# EAGLE schematic shiht_register's_board (EAGLE 8.3.2)
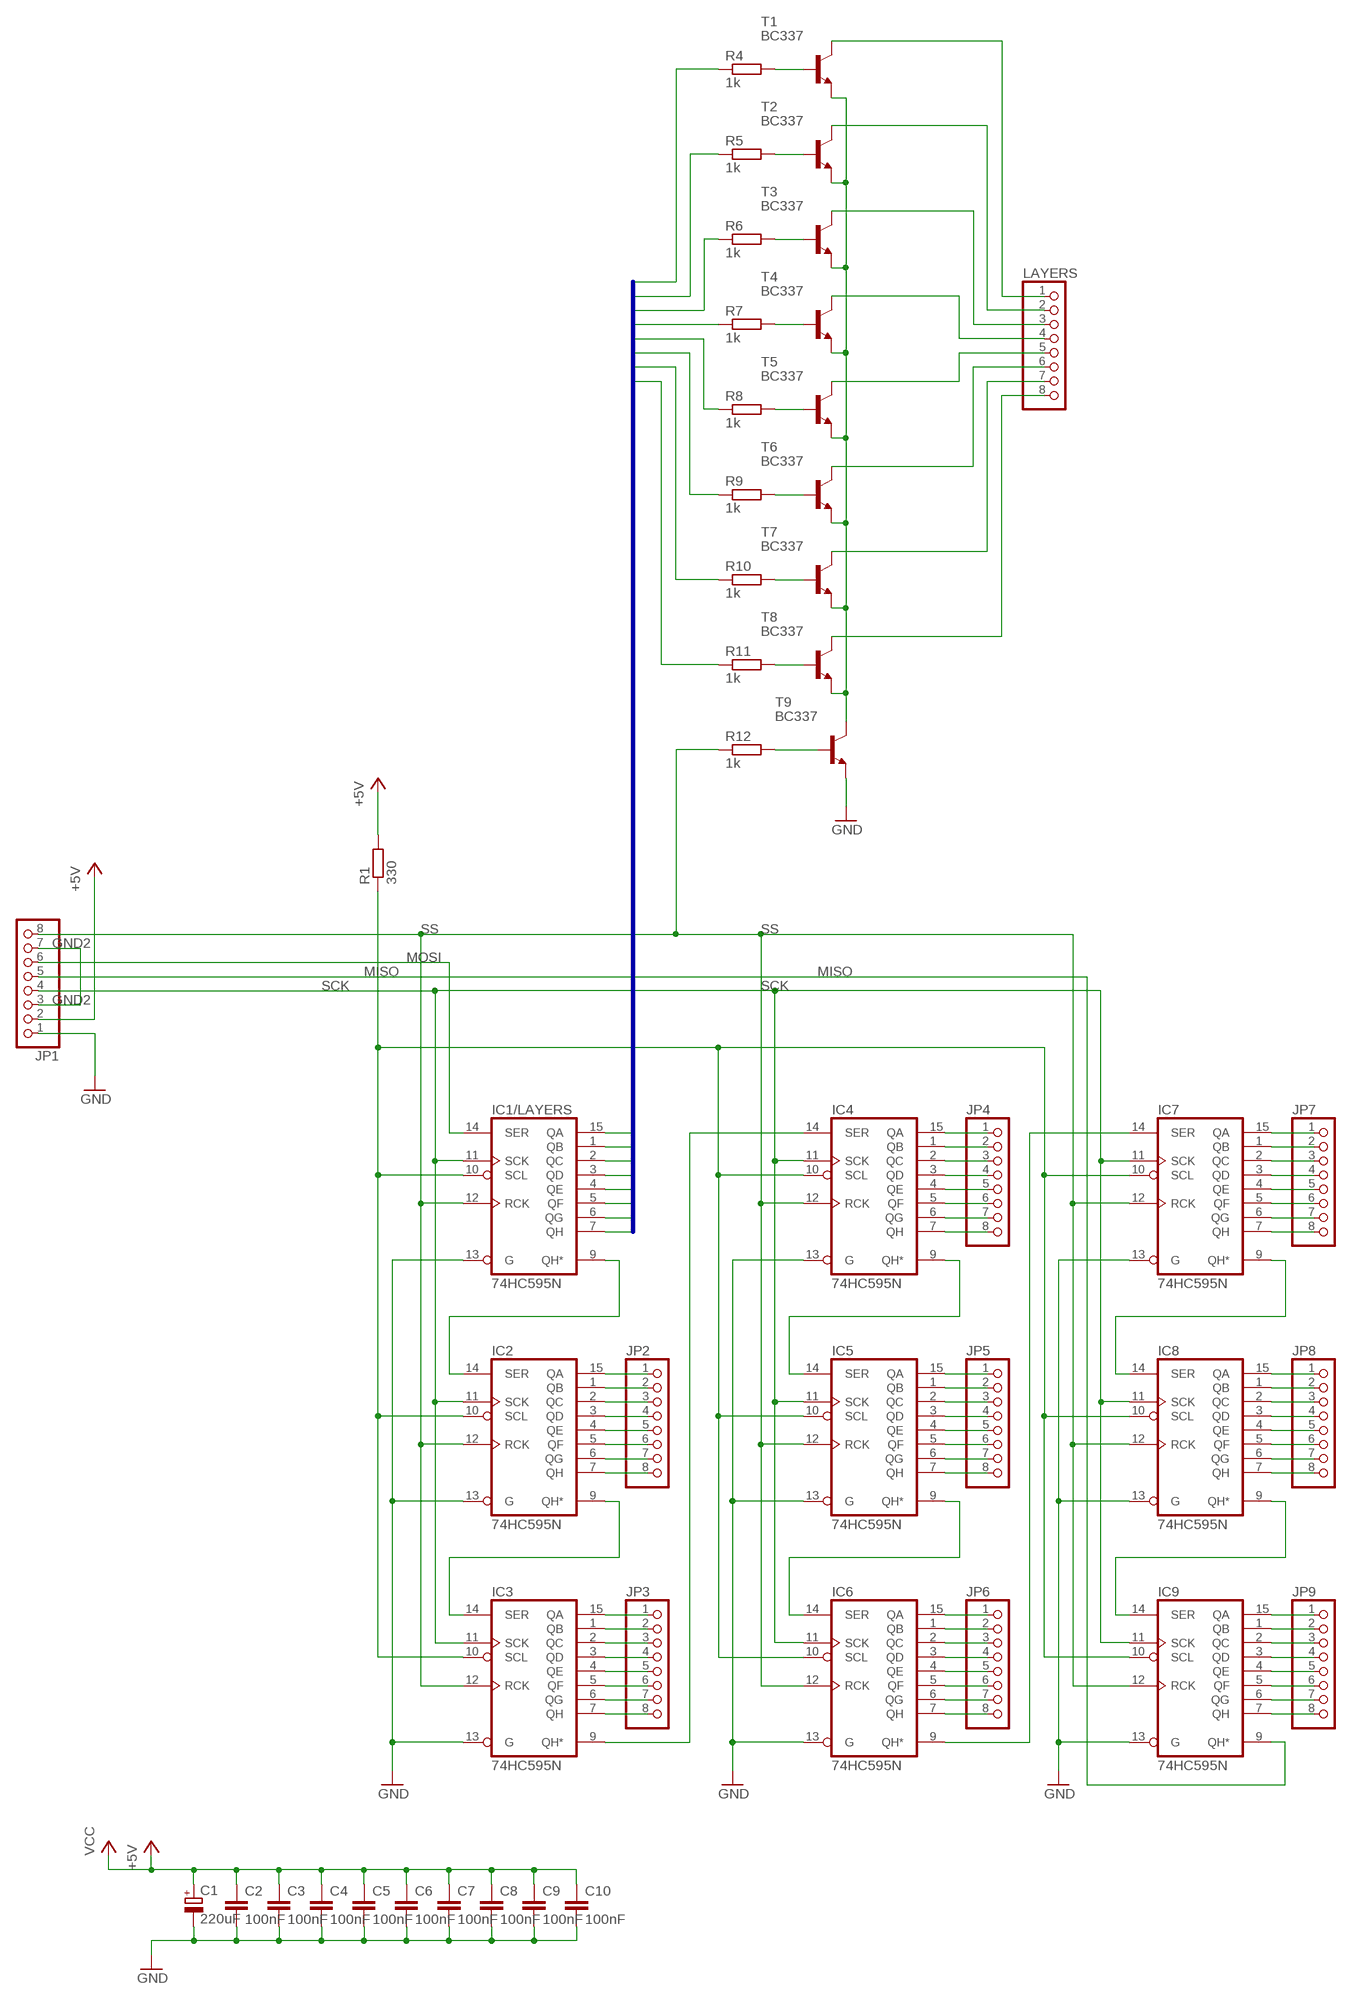
[diagram p0: schematic, sheet 1]

## Parts
C1  220uF  CPOL-EUE3.5-8  [E3,5-8]
C2  100nF  C-EU025-025X050  [C025-025X050]
C3  100nF  C-EU025-025X050  [C025-025X050]
C4  100nF  C-EU025-025X050  [C025-025X050]
C5  100nF  C-EU025-025X050  [C025-025X050]
C6  100nF  C-EU025-025X050  [C025-025X050]
C7  100nF  C-EU025-025X050  [C025-025X050]
C8  100nF  C-EU025-025X050  [C025-025X050]
C9  100nF  C-EU025-025X050  [C025-025X050]
C10  100nF  C-EU025-025X050  [C025-025X050]
IC1/LAYERS  74HC595N  [DIL16]
IC2  74HC595N  [DIL16]
IC3  74HC595N  [DIL16]
IC4  74HC595N  [DIL16]
IC5  74HC595N  [DIL16]
IC6  74HC595N  [DIL16]
IC7  74HC595N  [DIL16]
IC8  74HC595N  [DIL16]
IC9  74HC595N  [DIL16]
JP1  PINHD-1X8  [1X08]
JP2  PINHD-1X8  [1X08]
JP3  PINHD-1X8  [1X08]
JP4  PINHD-1X8  [1X08]
JP5  PINHD-1X8  [1X08]
JP6  PINHD-1X8  [1X08]
JP7  PINHD-1X8  [1X08]
JP8  PINHD-1X8  [1X08]
JP9  PINHD-1X8  [1X08]
LAYERS  PINHD-1X8  [1X08]
R1  330  R-EU_0207/2V  [0207/2V]
R4  1k  R-EU_0207/2V  [0207/2V]
R5  1k  R-EU_0207/2V  [0207/2V]
R6  1k  R-EU_0207/2V  [0207/2V]
R7  1k  R-EU_0207/2V  [0207/2V]
R8  1k  R-EU_0207/2V  [0207/2V]
R9  1k  R-EU_0207/2V  [0207/2V]
R10  1k  R-EU_0207/2V  [0207/2V]
R11  1k  R-EU_0207/2V  [0207/2V]
R12  1k  R-EU_0207/2V  [0207/2V]
T1  BC337  [TO92]
T2  BC337  [TO92]
T3  BC337  [TO92]
T4  BC337  [TO92]
T5  BC337  [TO92]
T6  BC337  [TO92]
T7  BC337  [TO92]
T8  BC337  [TO92]
T9  BC337  [TO92]

## Nets
+5V: JP1.2 R1.2
GND: C1.- C2.2 C3.2 C4.2 C5.2 C6.2 C7.2 C8.2 C9.2 C10.2 IC1/LAYERS.13(G) IC2.13(G) IC3.13(G) IC4.13(G) IC5.13(G) IC6.13(G) IC7.13(G) IC8.13(G) IC9.13(G) JP1.1 T9.1(E)
GND2: JP1.3 JP1.7
LAYER1: IC1/LAYERS.15(QA) R4.1
LAYER2: IC1/LAYERS.1(QB) R5.1
LAYER3: IC1/LAYERS.2(QC) R6.1
LAYER4: IC1/LAYERS.3(QD) R7.1
LAYER5: IC1/LAYERS.4(QE) R8.1
LAYER6: IC1/LAYERS.5(QF) R9.1
LAYER7: IC1/LAYERS.6(QG) R10.1
LAYER8: IC1/LAYERS.7(QH) R11.1
MISO: IC9.9(QH*) JP1.5
MOSI: IC1/LAYERS.14(SER) JP1.6
N$1: IC9.15(QA) JP9.1
N$2: IC9.1(QB) JP9.2
N$3: IC9.2(QC) JP9.3
N$4: IC9.3(QD) JP9.4
N$5: IC9.4(QE) JP9.5
N$6: IC9.5(QF) JP9.6
N$7: IC9.6(QG) JP9.7
N$8: IC9.7(QH) JP9.8
N$9: IC2.15(QA) JP2.1
N$10: IC2.1(QB) JP2.2
N$11: IC2.2(QC) JP2.3
N$12: IC2.3(QD) JP2.4
N$13: IC2.4(QE) JP2.5
N$14: IC2.5(QF) JP2.6
N$15: IC2.6(QG) JP2.7
N$16: IC2.7(QH) JP2.8
N$17: IC3.15(QA) JP3.1
N$18: IC3.1(QB) JP3.2
N$19: IC3.2(QC) JP3.3
N$20: IC3.3(QD) JP3.4
N$21: IC3.4(QE) JP3.5
N$22: IC3.5(QF) JP3.6
N$23: IC3.6(QG) JP3.7
N$24: IC3.7(QH) JP3.8
N$25: IC6.15(QA) JP6.1
N$26: IC6.1(QB) JP6.2
N$27: IC6.2(QC) JP6.3
N$28: IC6.3(QD) JP6.4
N$29: IC6.4(QE) JP6.5
N$30: IC6.5(QF) JP6.6
N$31: IC6.6(QG) JP6.7
N$32: IC6.7(QH) JP6.8
N$33: IC5.15(QA) JP5.1
N$34: IC5.1(QB) JP5.2
N$35: IC5.2(QC) JP5.3
N$36: IC5.3(QD) JP5.4
N$37: IC5.4(QE) JP5.5
N$38: IC5.5(QF) JP5.6
N$39: IC5.6(QG) JP5.7
N$40: IC5.7(QH) JP5.8
N$41: IC8.15(QA) JP8.1
N$42: IC8.1(QB) JP8.2
N$43: IC8.2(QC) JP8.3
N$44: IC8.3(QD) JP8.4
N$45: IC8.4(QE) JP8.5
N$46: IC8.5(QF) JP8.6
N$47: IC8.6(QG) JP8.7
N$48: IC8.7(QH) JP8.8
N$49: IC7.15(QA) JP7.1
N$50: IC7.1(QB) JP7.2
N$51: IC7.2(QC) JP7.3
N$52: IC7.3(QD) JP7.4
N$53: IC7.4(QE) JP7.5
N$54: IC7.5(QF) JP7.6
N$55: IC7.6(QG) JP7.7
N$56: IC7.7(QH) JP7.8
N$57: IC4.15(QA) JP4.1
N$58: IC4.1(QB) JP4.2
N$59: IC4.2(QC) JP4.3
N$60: IC4.3(QD) JP4.4
N$61: IC4.4(QE) JP4.5
N$62: IC4.5(QF) JP4.6
N$63: IC4.6(QG) JP4.7
N$64: IC4.7(QH) JP4.8
N$66: IC1/LAYERS.9(QH*) IC2.14(SER)
N$67: IC2.9(QH*) IC3.14(SER)
N$68: IC3.9(QH*) IC4.14(SER)
N$69: IC4.9(QH*) IC5.14(SER)
N$70: IC5.9(QH*) IC6.14(SER)
N$71: IC6.9(QH*) IC7.14(SER)
N$72: IC7.9(QH*) IC8.14(SER)
N$73: IC8.9(QH*) IC9.14(SER)
N$74: LAYERS.1 T1.3(C)
N$75: LAYERS.2 T2.3(C)
N$76: LAYERS.3 T3.3(C)
N$77: LAYERS.4 T4.3(C)
N$78: LAYERS.5 T5.3(C)
N$79: IC1/LAYERS.10(SCL) IC2.10(SCL) IC3.10(SCL) IC4.10(SCL) IC5.10(SCL) IC6.10(SCL) IC7.10(SCL) IC8.10(SCL) IC9.10(SCL) R1.1
N$81: LAYERS.6 T6.3(C)
N$82: LAYERS.7 T7.3(C)
N$83: LAYERS.8 T8.3(C)
N$84: T1.1(E) T2.1(E) T3.1(E) T4.1(E) T5.1(E) T6.1(E) T7.1(E) T8.1(E) T9.3(C)
N$85: R4.2 T1.2(B)
N$86: R5.2 T2.2(B)
N$87: R6.2 T3.2(B)
N$88: R7.2 T4.2(B)
N$89: R8.2 T5.2(B)
N$90: R9.2 T6.2(B)
N$91: R10.2 T7.2(B)
N$92: R11.2 T8.2(B)
N$101: R12.2 T9.2(B)
SCK: IC1/LAYERS.11(SCK) IC2.11(SCK) IC3.11(SCK) IC4.11(SCK) IC5.11(SCK) IC6.11(SCK) IC7.11(SCK) IC8.11(SCK) IC9.11(SCK) JP1.4
SS: IC1/LAYERS.12(RCK) IC2.12(RCK) IC3.12(RCK) IC4.12(RCK) IC5.12(RCK) IC6.12(RCK) IC7.12(RCK) IC8.12(RCK) IC9.12(RCK) JP1.8 R12.1
VCC: C1.+ C2.1 C3.1 C4.1 C5.1 C6.1 C7.1 C8.1 C9.1 C10.1 ; supply symbol labelled +5V

## Buses
LAYER[1..8]

## Power pins joined to a net without a drawn wire
GND: IC1/LAYERS.8(GND) IC2.8(GND) IC3.8(GND) IC4.8(GND) IC5.8(GND) IC6.8(GND) IC7.8(GND) IC8.8(GND) IC9.8(GND)
VCC: IC1/LAYERS.16(VCC) IC2.16(VCC) IC3.16(VCC) IC4.16(VCC) IC5.16(VCC) IC6.16(VCC) IC7.16(VCC) IC8.16(VCC) IC9.16(VCC)

## Library data of the parts
C1 = rcl:CPOL-EU: POLARIZED CAPACITOR, European symbol
C2-C10 = rcl:C-EU: CAPACITOR, European symbol
IC1/LAYERS IC2-IC9 = 74xx-eu:74*595: 8-bit SHIFT REGISTER, output latch
JP1-JP9 LAYERS = pinhead:PINHD-1X8: PIN HEADER
R1 R4-R12 = rcl:R-EU_: RESISTOR, European symbol
T1-T9 = transistor:BC337: NPN TRANSISTOR